# Altium schematic sheet fmc_connector.SchDoc: Fine Delay FMC
size 297 x 209 mm; CheckedBy: B. Civel; Author: M.C., T.W., E.B.; CompanyName: CERN; DrawnBy: TW, GK; Engineer: TW; Organization: CERN; Address1: European Organization for Nuclear Research; Address2: CH-1211 Geneve 23 - SwitzerLA_Pd; DocumentNumber: 3; Revision: -; SheetNumber: 3; SheetTotal: 10; ModifiedBy: B. Civel; CreateDate: 10/07/2010; CheckedDate: 06/06/2013; Title2: FMC connector wiring; Designer: TW, GK; PageSetup: Record=PageOptions|CenterHorizontal=True|CenterVertical=True|PrintScale=0.96|XCorrection=1.00|YCorrection=1.00|PrintKind=1|BorderSize=5000000|LeftOffset=0|BottomOffset=0|Orientation=2|PaperLength=1000|PaperWidth=1000|Scale=100|PaperSource=15|PrintQuality=600|MediaType=1|DitherType=10|PaperKind=A3|PrintScaleMode=1; Projet: Fine Delay FMC (FMCDel1ns4cha); DivGrp: BE-CO; EDA_Number: EDA-02267-V6-0; ModifiedDate: 16/08/2012
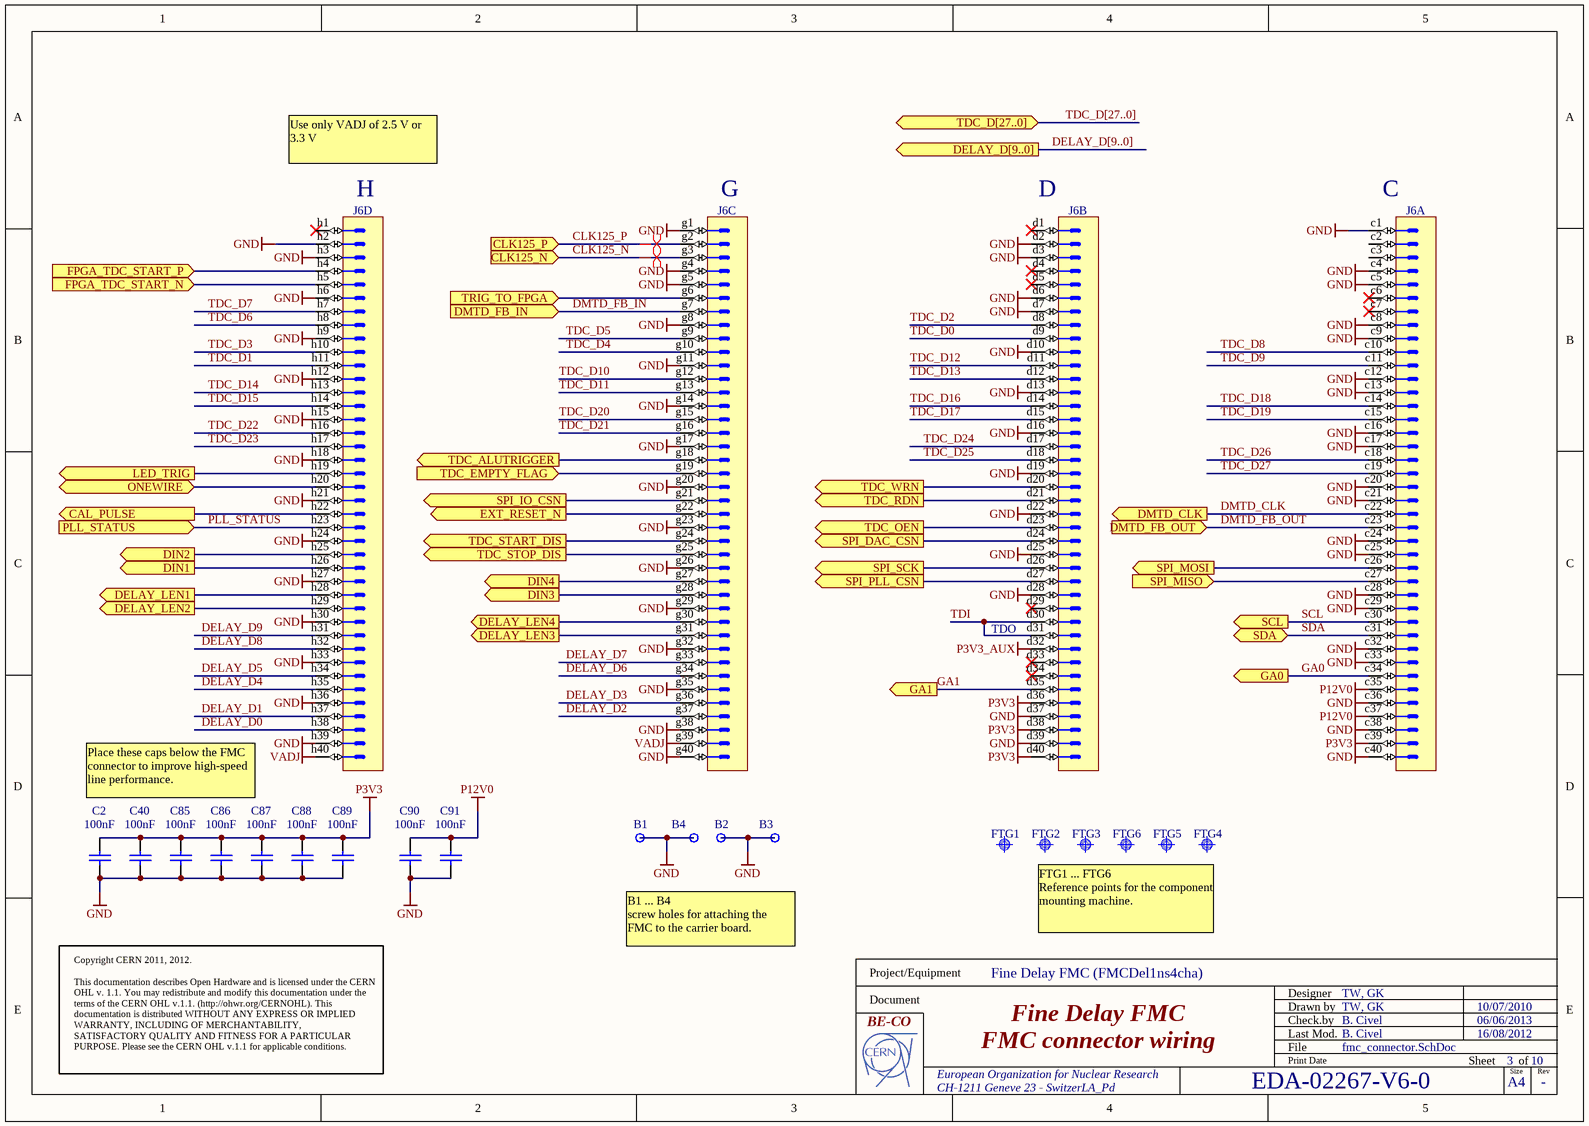
[diagram p0: fmc_connector.SchDoc]

## Parts
B1  Plated Hole  [MTG300_600]  (value not drawn)
B2  Plated Hole  [MTG300_600]  (value not drawn)
B3  Plated Hole  [MTG300_600]  (value not drawn)
B4  Plated Hole  [MTG300_600]  (value not drawn)
C2  100nF  [CAPC1608X87N]
C40  100nF  [CAPC1608X87N]
C85  100nF  [CAPC1608X87N]
C86  100nF  [CAPC1608X87N]
C87  100nF  [CAPC1608X87N]
C88  100nF  [CAPC1608X87N]
C89  100nF  [CAPC1608X87N]
C90  100nF  [CAPC1608X87N]
C91  100nF  [CAPC1608X87N]
FTG1  Use only in PCB  [FIDUCIAL_TOP_S100-200]  (value not drawn)
FTG2  Use only in PCB  [FIDUCIAL_TOP_S100-200]  (value not drawn)
FTG3  Use only in PCB  [FIDUCIAL_TOP_S100-200]  (value not drawn)
FTG4  Use only in PCB  [FIDUCIAL_TOP_S100-200]  (value not drawn)
FTG5  Use only in PCB  [FIDUCIAL_TOP_S100-200]  (value not drawn)
FTG6  Use only in PCB  [FIDUCIAL_TOP_S100-200]  (value not drawn)
J6  VITA 57  [SAMTEC_ASP-134604-01]  (value not drawn)  (parts A,B,C,D of 4)

## Ports
CAL_PULSE (out), CLK125_N (in), CLK125_P (in), DELAY_D[9..0] (out), DELAY_LEN1 (out), DELAY_LEN2 (out), DELAY_LEN3 (out), DELAY_LEN4 (out), DIN1 (out), DIN2 (out), DIN3 (out), DIN4 (out), DMTD_CLK (out), DMTD_FB_IN (in), DMTD_FB_OUT (in), EXT_RESET_N (out), FPGA_TDC_START_N (in), FPGA_TDC_START_P (in), GA0 (out), GA1 (out), LED_TRIG (out), ONEWIRE (bidir), PLL_STATUS (in), SCL (out), SDA (bidir), SPI_DAC_CSN (out), SPI_IO_CSN (out), SPI_MISO (in), SPI_MOSI (out), SPI_PLL_CSN (out), SPI_SCK (out), TDC_ALUTRIGGER (out), TDC_D[27..0] (bidir), TDC_EMPTY_FLAG (in), TDC_OEN (out), TDC_RDN (out), TDC_START_DIS (out), TDC_STOP_DIS (out), TDC_WRN (out), TRIG_TO_FPGA (in)

## Nets
GND: B1.1 B2.1 B3.1 B4.1 C2.1 C40.1 C85.1 C86.1 C87.1 C88.1 C89.1 C90.1 C91.1 J6.c1 J6.c4 J6.c5 J6.c8 J6.c9 J6.c12 J6.c13 J6.c16 J6.c17 J6.c20 J6.c21 J6.c24 J6.c25 J6.c28 J6.c29 J6.c32 J6.c33 J6.c36 J6.c38 J6.c40 J6.d2 J6.d3 J6.d6 J6.d7 J6.d10 J6.d13 J6.d16 J6.d19 J6.d22 J6.d25 J6.d28 J6.d37 J6.d39 J6.g1 J6.g4 J6.g5 J6.g8 J6.g11 J6.g14 J6.g17 J6.g20 J6.g23 J6.g26 J6.g29 J6.g32 J6.g35 J6.g38 J6.g40 J6.h2 J6.h3 J6.h6 J6.h9 J6.h12 J6.h15 J6.h18 J6.h21 J6.h24 J6.h27 J6.h30 J6.h33 J6.h36 J6.h39
P3V3: C2.2 C40.2 C85.2 C86.2 C87.2 C88.2 C89.2 J6.c39 J6.d36 J6.d38 J6.d40
P3V3_AUX: J6.d32
P12V0: C90.2 C91.2 J6.c35 J6.c37
VADJ: J6.g39 J6.h40
CAL_PULSE: J6.h22 ; port CAL_PULSE
CLK125_N: J6.g3 ; port CLK125_N
CLK125_P: J6.g2 ; port CLK125_P
DELAY_D0: J6.h38
DELAY_D1: J6.h37
DELAY_D2: J6.g37
DELAY_D3: J6.g36
DELAY_D4: J6.h35
DELAY_D5: J6.h34
DELAY_D6: J6.g34
DELAY_D7: J6.g33
DELAY_D8: J6.h32
DELAY_D9: J6.h31
DELAY_LEN1: J6.h28 ; port DELAY_LEN1
DELAY_LEN2: J6.h29 ; port DELAY_LEN2
DELAY_LEN3: J6.g31 ; port DELAY_LEN3
DELAY_LEN4: J6.g30 ; port DELAY_LEN4
DIN1: J6.h26 ; port DIN1
DIN2: J6.h25 ; port DIN2
DIN3: J6.g28 ; port DIN3
DIN4: J6.g27 ; port DIN4
DMTD_CLK: J6.c22 ; port DMTD_CLK
DMTD_FB_IN: J6.g7 ; port DMTD_FB_IN
DMTD_FB_OUT: J6.c23 ; port DMTD_FB_OUT
EXT_RESET_N: J6.g22 ; port EXT_RESET_N
FPGA_TDC_START_N: J6.h5 ; port FPGA_TDC_START_N
FPGA_TDC_START_P: J6.h4 ; port FPGA_TDC_START_P
GA0: J6.c34 ; port GA0
GA1: J6.d35 ; port GA1
LED_TRIG: J6.h19 ; port LED_TRIG
ONEWIRE: J6.h20 ; port ONEWIRE
PLL_STATUS: J6.h23 ; port PLL_STATUS
SCL: J6.c30 ; port SCL
SDA: J6.c31 ; port SDA
SPI_DAC_CSN: J6.d24 ; port SPI_DAC_CSN
SPI_IO_CSN: J6.g21 ; port SPI_IO_CSN
SPI_MISO: J6.c27 ; port SPI_MISO
SPI_MOSI: J6.c26 ; port SPI_MOSI
SPI_PLL_CSN: J6.d27 ; port SPI_PLL_CSN
SPI_SCK: J6.d26 ; port SPI_SCK
TDC_ALUTRIGGER: J6.g18 ; port TDC_ALUTRIGGER
TDC_D0: J6.d9
TDC_D1: J6.h11
TDC_D2: J6.d8
TDC_D3: J6.h10
TDC_D4: J6.g10
TDC_D5: J6.g9
TDC_D6: J6.h8
TDC_D7: J6.h7
TDC_D8: J6.c10
TDC_D9: J6.c11
TDC_D10: J6.g12
TDC_D11: J6.g13
TDC_D12: J6.d11
TDC_D13: J6.d12
TDC_D14: J6.h13
TDC_D15: J6.h14
TDC_D16: J6.d14
TDC_D17: J6.d15
TDC_D18: J6.c14
TDC_D19: J6.c15
TDC_D20: J6.g15
TDC_D21: J6.g16
TDC_D22: J6.h16
TDC_D23: J6.h17
TDC_D24: J6.d17
TDC_D25: J6.d18
TDC_D26: J6.c18
TDC_D27: J6.c19
TDC_EMPTY_FLAG: J6.g19 ; port TDC_EMPTY_FLAG
TDC_OEN: J6.d23 ; port TDC_OEN
TDC_RDN: J6.d21 ; port TDC_RDN
TDC_START_DIS: J6.g24 ; port TDC_START_DIS
TDC_STOP_DIS: J6.g25 ; port TDC_STOP_DIS
TDC_WRN: J6.d20 ; port TDC_WRN
TDI: J6.d30 J6.d31
TRIG_TO_FPGA: J6.g6 ; port TRIG_TO_FPGA

Not connected (* = marked no-connect by the designer): J6 c2 c3 c6* c7* d1* d4* d5* d29* d33* d34* h1*

## Buses and harness runs
bus DELAY_D[9..0] = port DELAY_D[9..0]
bus TDC_D[27..0] = port TDC_D[27..0]

## Layout directives
differential pair: CLK125_N, CLK125_P

## Notes on the sheet
- Use only VADJ of 2.5 V or 3.3 V
- (near J6) H
- (near J6) G
- (near J6) D
- (near J6) C
- (near J6) TDO
- Place these caps below the FMC connector to improve high-speed line performance.
- B1 ... B4
  screw holes for attaching the FMC to the carrier board.
- FTG1 ... FTG6
  Reference points for the component mounting machine.
- Copyright CERN 2011, 2012.
  This documentation describes Open Hardware and is licensed under the CERN OHL v. 1.1. You may redistribute and modify this documentation under the terms of the CERN OHL v.1.1. (http://ohwr.org/CERNOHL). This documentation is distributed WITHOUT ANY EXPRESS OR IMPLIED WARRANTY, INCLUDING OF MERCHANTABILITY, SATISFACTORY QUALITY AND FITNESS FOR A PARTICULAR PURPOSE. Please see the CERN OHL v.1.1 for applicable conditions.
- Project/Equipment
- Document
- Designer
- Drawn by
- Check.by
- File
- Last Mod.
- Print Date
- Sheet
- Size
- A4
- of
- Rev

## Library data of the parts
B1-B4 = PLATED_HOLE3.0_PAD6.0: Single Terminal Socket; Part Description: Plated Through Hole: Hole Dia.=3.0mm Pad Dia.=6.0mm; Mounted: No; Table: Pads; Part Number: PLATED_HOLE3.0_PAD6.0; Component Kind: Standard (No BOM); Component Type: Standard (No BOM); Designator: Single Terminal Socket; Library Reference: Single Terminal Socket; Pin Count: 1; Family: Plated Hole; Socket: No; SMD: No; Status: None; ComponentHeight: 0mm; Author: CERN DEM JLC; CreateDate: 5/26/2008; LatestRevisionDate: 5/26/2008; PackageDescription: Plated Through Hole: Hole Dia.=3.0mm Pad Dia.=6.0mm
C2 C40 C85-C91 = CC0603_100NF_50V_10%_X7R: Non-polarised capacitor; Part Description: SMD Multilayer Chip Ceramic Capacitor; Manufacturer: GENERIC; Manufacturer1 Part Number: 223858615649; Voltage: 50V; TC: X7R; Tolerance: ±10%; Table: Capacitors SMD; Part Number: CC0603_100NF_50V_10%_X7R; Component Kind: Standard; Component Type: Standard; Pin Count: 2; Value: 100nF; Status: Preferred; Manufacturer Part Number: CC0603_100NF_50V_10%_X7R; Case: 0603; Mounted: Yes; Socket: No; SMD: Yes; Manufacturer1 Example: PHYCOMP; Manufacturer1 ComponentHeight: 0.87mm; HelpURL: \\cern.ch\dfs\Applications\Altium\Datasheets\CC0603_X7R_PHYCOMP.pdf; Author: CERN DEM JLC; CreateDate: 12/3/2007; LatestRevisionDate: 12/3/2007
FTG1-FTG6 = FIDUCIAL_TARGET_S100-200: Fiducial Target; Part Description: Square Fiducial Target, Top Layer, 1.0mm, Top Solder 2.0mm, Keepout =2.0mm; Mounted: No; Table: Pads; Part Number: FIDUCIAL_TARGET_S100-200; Component Kind: Standard (No BOM); Component Type: Standard (No BOM); Pin Count: 1; Family: Fiducial; Socket: No; SMD: Yes; Status: None; ComponentHeight: 0mm; Author: CERN DEM JLC; CreateDate: 09/02/2010; LatestRevisionDate: 04/04/2012; PackageDescription: Square Fiducial Target, Top Layer, 1.0mm, Top Solder 2.0mm, Keepout =2.0mm
J6 = SAMTEC_ASP-134604-01: Connector VITA 57, 160 Male contacts in 4 row cdgh; Part Description: 160 contacts (4 rows cdgh) Surface Mount Male Connector, VITA 57 (MC-LPC-10); Manufacturer: SAMTEC; Part Number: SAMTEC_ASP-134604-01; Component Kind: Standard; Component Type: Standard; Pin Count: 160; Family: VITA 57; Mounted: Yes; Socket: No; SMD: Yes; Status: None; Manufacturer Part Number: ASP-134604-01; ComponentHeight: 6.1mm; HelpURL: \\cern.ch\dfs\Applications\Altium\Datasheets\SAMTEC_ASP-134604-01.pdf; Author: CERN DEM JLC; CreateDate: 8/31/2011; LatestRevisionDate: 8/31/2011; Table: SAMTEC